# Altium schematic sheet SCH_SEGEMENTOS_MINUTERO_2.SchDoc: TP Final - Reloj - Display Minuto 2
size A4; Author: Luciano Lopez; CompanyName: UTN - FRBA; Revision: 1; SheetNumber: 8; SheetTotal: 10
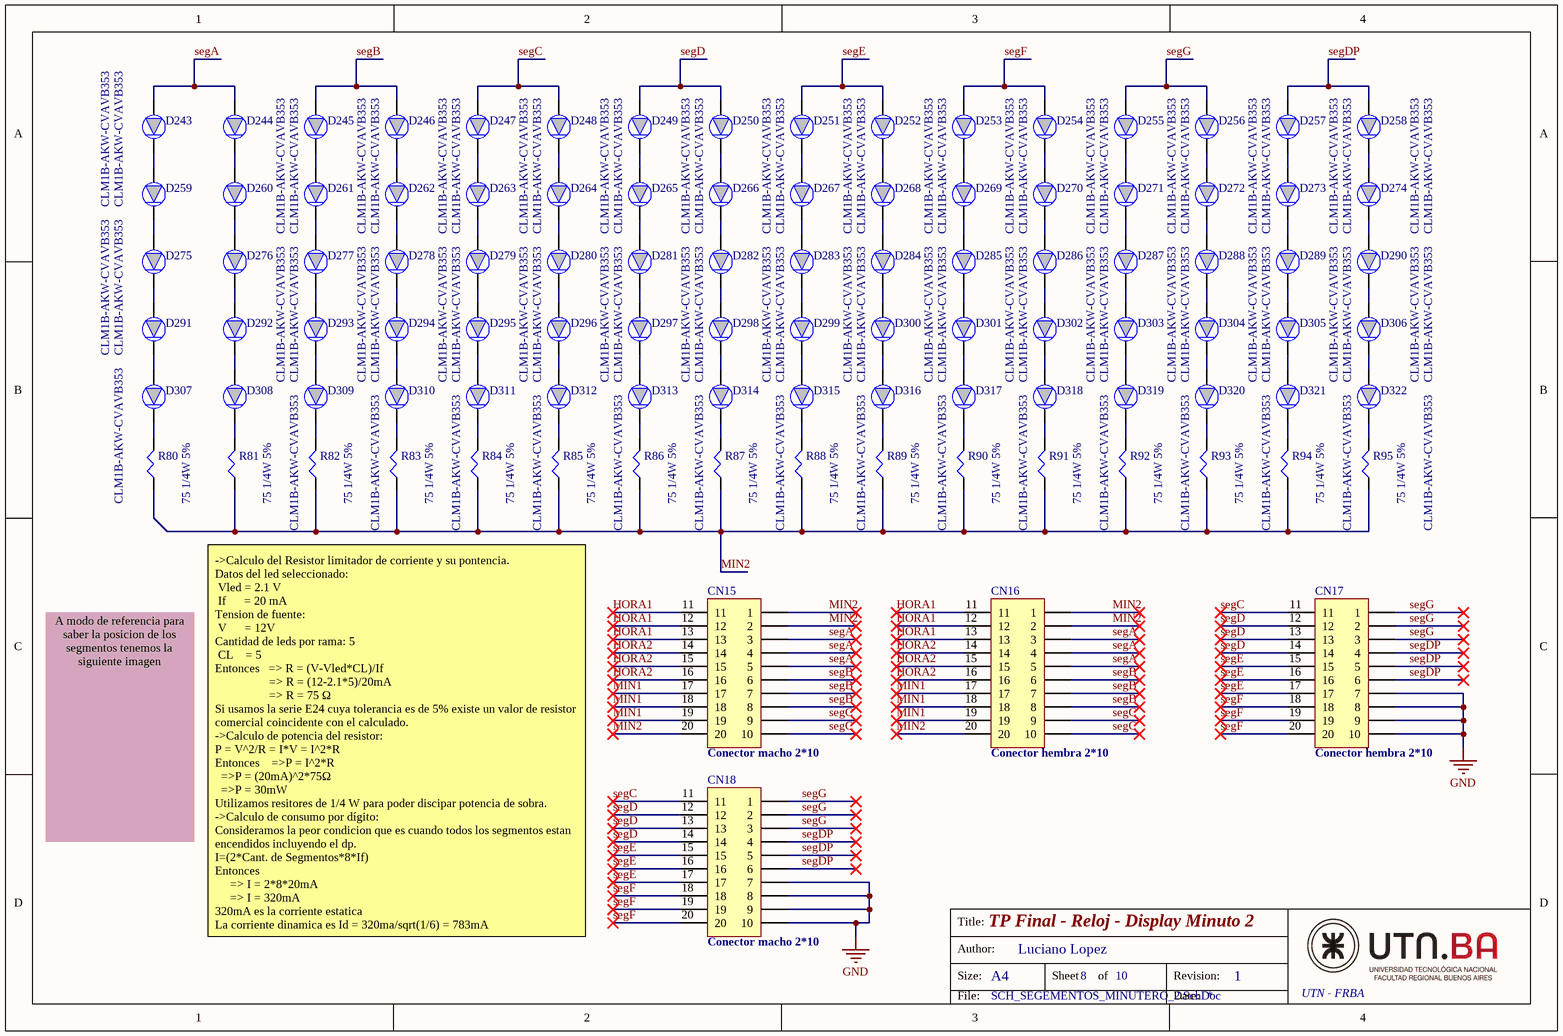
[diagram p0: SCH_SEGEMENTOS_MINUTERO_2.SchDoc]

## Parts
CN15  Conector macho 2*10
CN16  Conector hembra 2*10
CN17  Conector hembra 2*10
CN18  Conector macho 2*10
D243  CLM1B-AKW-CVAVB353  [PLCC2_LED]
D244  CLM1B-AKW-CVAVB353  [PLCC2_LED]
D245  CLM1B-AKW-CVAVB353  [PLCC2_LED]
D246  CLM1B-AKW-CVAVB353  [PLCC2_LED]
D247  CLM1B-AKW-CVAVB353  [PLCC2_LED]
D248  CLM1B-AKW-CVAVB353  [PLCC2_LED]
D249  CLM1B-AKW-CVAVB353  [PLCC2_LED]
D250  CLM1B-AKW-CVAVB353  [PLCC2_LED]
D251  CLM1B-AKW-CVAVB353  [PLCC2_LED]
D252  CLM1B-AKW-CVAVB353  [PLCC2_LED]
D253  CLM1B-AKW-CVAVB353  [PLCC2_LED]
D254  CLM1B-AKW-CVAVB353  [PLCC2_LED]
D255  CLM1B-AKW-CVAVB353  [PLCC2_LED]
D256  CLM1B-AKW-CVAVB353  [PLCC2_LED]
D257  CLM1B-AKW-CVAVB353  [PLCC2_LED]
D258  CLM1B-AKW-CVAVB353  [PLCC2_LED]
D259  CLM1B-AKW-CVAVB353  [PLCC2_LED]
D260  CLM1B-AKW-CVAVB353  [PLCC2_LED]
D261  CLM1B-AKW-CVAVB353  [PLCC2_LED]
D262  CLM1B-AKW-CVAVB353  [PLCC2_LED]
D263  CLM1B-AKW-CVAVB353  [PLCC2_LED]
D264  CLM1B-AKW-CVAVB353  [PLCC2_LED]
D265  CLM1B-AKW-CVAVB353  [PLCC2_LED]
D266  CLM1B-AKW-CVAVB353  [PLCC2_LED]
D267  CLM1B-AKW-CVAVB353  [PLCC2_LED]
D268  CLM1B-AKW-CVAVB353  [PLCC2_LED]
D269  CLM1B-AKW-CVAVB353  [PLCC2_LED]
D270  CLM1B-AKW-CVAVB353  [PLCC2_LED]
D271  CLM1B-AKW-CVAVB353  [PLCC2_LED]
D272  CLM1B-AKW-CVAVB353  [PLCC2_LED]
D273  CLM1B-AKW-CVAVB353  [PLCC2_LED]
D274  CLM1B-AKW-CVAVB353  [PLCC2_LED]
D275  CLM1B-AKW-CVAVB353  [PLCC2_LED]
D276  CLM1B-AKW-CVAVB353  [PLCC2_LED]
D277  CLM1B-AKW-CVAVB353  [PLCC2_LED]
D278  CLM1B-AKW-CVAVB353  [PLCC2_LED]
D279  CLM1B-AKW-CVAVB353  [PLCC2_LED]
D280  CLM1B-AKW-CVAVB353  [PLCC2_LED]
D281  CLM1B-AKW-CVAVB353  [PLCC2_LED]
D282  CLM1B-AKW-CVAVB353  [PLCC2_LED]
D283  CLM1B-AKW-CVAVB353  [PLCC2_LED]
D284  CLM1B-AKW-CVAVB353  [PLCC2_LED]
D285  CLM1B-AKW-CVAVB353  [PLCC2_LED]
D286  CLM1B-AKW-CVAVB353  [PLCC2_LED]
D287  CLM1B-AKW-CVAVB353  [PLCC2_LED]
D288  CLM1B-AKW-CVAVB353  [PLCC2_LED]
D289  CLM1B-AKW-CVAVB353  [PLCC2_LED]
D290  CLM1B-AKW-CVAVB353  [PLCC2_LED]
D291  CLM1B-AKW-CVAVB353  [PLCC2_LED]
D292  CLM1B-AKW-CVAVB353  [PLCC2_LED]
D293  CLM1B-AKW-CVAVB353  [PLCC2_LED]
D294  CLM1B-AKW-CVAVB353  [PLCC2_LED]
D295  CLM1B-AKW-CVAVB353  [PLCC2_LED]
D296  CLM1B-AKW-CVAVB353  [PLCC2_LED]
D297  CLM1B-AKW-CVAVB353  [PLCC2_LED]
D298  CLM1B-AKW-CVAVB353  [PLCC2_LED]
D299  CLM1B-AKW-CVAVB353  [PLCC2_LED]
D300  CLM1B-AKW-CVAVB353  [PLCC2_LED]
D301  CLM1B-AKW-CVAVB353  [PLCC2_LED]
D302  CLM1B-AKW-CVAVB353  [PLCC2_LED]
D303  CLM1B-AKW-CVAVB353  [PLCC2_LED]
D304  CLM1B-AKW-CVAVB353  [PLCC2_LED]
D305  CLM1B-AKW-CVAVB353  [PLCC2_LED]
D306  CLM1B-AKW-CVAVB353  [PLCC2_LED]
D307  CLM1B-AKW-CVAVB353  [PLCC2_LED]
D308  CLM1B-AKW-CVAVB353  [PLCC2_LED]
D309  CLM1B-AKW-CVAVB353  [PLCC2_LED]
D310  CLM1B-AKW-CVAVB353  [PLCC2_LED]
D311  CLM1B-AKW-CVAVB353  [PLCC2_LED]
D312  CLM1B-AKW-CVAVB353  [PLCC2_LED]
D313  CLM1B-AKW-CVAVB353  [PLCC2_LED]
D314  CLM1B-AKW-CVAVB353  [PLCC2_LED]
D315  CLM1B-AKW-CVAVB353  [PLCC2_LED]
D316  CLM1B-AKW-CVAVB353  [PLCC2_LED]
D317  CLM1B-AKW-CVAVB353  [PLCC2_LED]
D318  CLM1B-AKW-CVAVB353  [PLCC2_LED]
D319  CLM1B-AKW-CVAVB353  [PLCC2_LED]
D320  CLM1B-AKW-CVAVB353  [PLCC2_LED]
D321  CLM1B-AKW-CVAVB353  [PLCC2_LED]
D322  CLM1B-AKW-CVAVB353  [PLCC2_LED]
R80  75 1/4W 5%  [R_0805]
R81  75 1/4W 5%  [R_0805]
R82  75 1/4W 5%  [R_0805]
R83  75 1/4W 5%  [R_0805]
R84  75 1/4W 5%  [R_0805]
R85  75 1/4W 5%  [R_0805]
R86  75 1/4W 5%  [R_0805]
R87  75 1/4W 5%  [R_0805]
R88  75 1/4W 5%  [R_0805]
R89  75 1/4W 5%  [R_0805]
R90  75 1/4W 5%  [R_0805]
R91  75 1/4W 5%  [R_0805]
R92  75 1/4W 5%  [R_0805]
R93  75 1/4W 5%  [R_0805]
R94  75 1/4W 5%  [R_0805]
R95  75 1/4W 5%  [R_0805]

## Nets
GND: CN17.7 CN17.8 CN17.9 CN17.10 CN18.7 CN18.8 CN18.9 CN18.10
HORA1: CN15.11 CN15.12 CN15.13 CN16.11 CN16.12 CN16.13
HORA2: CN15.14 CN15.15 CN15.16 CN16.14 CN16.15 CN16.16
MIN1: CN15.17 CN15.18 CN15.19 CN16.17 CN16.18 CN16.19
MIN2: CN15.1 CN15.2 CN15.20 CN16.1 CN16.2 CN16.20 R80.47 R81.47 R82.47 R83.47 R84.47 R85.47 R86.47 R87.47 R88.47 R89.47 R90.47 R91.47 R92.47 R93.47 R94.47 R95.47
segA: CN15.3 CN15.4 CN15.5 CN16.3 CN16.4 CN16.5 D243.12 D244.12
segB: CN15.6 CN15.7 CN15.8 CN16.6 CN16.7 CN16.8 D245.12 D246.12
segC: CN15.9 CN15.10 CN16.9 CN16.10 CN17.11 CN18.11 D247.12 D248.12
segD: CN17.12 CN17.13 CN17.14 CN18.12 CN18.13 CN18.14 D249.12 D250.12
segDP: CN17.4 CN17.5 CN17.6 CN18.4 CN18.5 CN18.6 D257.12 D258.12
segE: CN17.15 CN17.16 CN17.17 CN18.15 CN18.16 CN18.17 D251.12 D252.12
segF: CN17.18 CN17.19 CN17.20 CN18.18 CN18.19 CN18.20 D253.12 D254.12
segG: CN17.1 CN17.2 CN17.3 CN18.1 CN18.2 CN18.3 D255.12 D256.12
NetD243_11: D243.11 D259.12
NetD244_11: D244.11 D260.12
NetD245_11: D245.11 D261.12
NetD246_11: D246.11 D262.12
NetD247_11: D247.11 D263.12
NetD248_11: D248.11 D264.12
NetD249_11: D249.11 D265.12
NetD250_11: D250.11 D266.12
NetD251_11: D251.11 D267.12
NetD252_11: D252.11 D268.12
NetD253_11: D253.11 D269.12
NetD254_11: D254.11 D270.12
NetD255_11: D255.11 D271.12
NetD256_11: D256.11 D272.12
NetD257_11: D257.11 D273.12
NetD258_11: D258.11 D274.12
NetD259_11: D259.11 D275.12
NetD260_11: D260.11 D276.12
NetD261_11: D261.11 D277.12
NetD262_11: D262.11 D278.12
NetD263_11: D263.11 D279.12
NetD264_11: D264.11 D280.12
NetD265_11: D265.11 D281.12
NetD266_11: D266.11 D282.12
NetD267_11: D267.11 D283.12
NetD268_11: D268.11 D284.12
NetD269_11: D269.11 D285.12
NetD270_11: D270.11 D286.12
NetD271_11: D271.11 D287.12
NetD272_11: D272.11 D288.12
NetD273_11: D273.11 D289.12
NetD274_11: D274.11 D290.12
NetD275_11: D275.11 D291.12
NetD276_11: D276.11 D292.12
NetD277_11: D277.11 D293.12
NetD278_11: D278.11 D294.12
NetD279_11: D279.11 D295.12
NetD280_11: D280.11 D296.12
NetD281_11: D281.11 D297.12
NetD282_11: D282.11 D298.12
NetD283_11: D283.11 D299.12
NetD284_11: D284.11 D300.12
NetD285_11: D285.11 D301.12
NetD286_11: D286.11 D302.12
NetD287_11: D287.11 D303.12
NetD288_11: D288.11 D304.12
NetD289_11: D289.11 D305.12
NetD290_11: D290.11 D306.12
NetD291_11: D291.11 D307.12
NetD292_11: D292.11 D308.12
NetD293_11: D293.11 D309.12
NetD294_11: D294.11 D310.12
NetD295_11: D295.11 D311.12
NetD296_11: D296.11 D312.12
NetD297_11: D297.11 D313.12
NetD298_11: D298.11 D314.12
NetD299_11: D299.11 D315.12
NetD300_11: D300.11 D316.12
NetD301_11: D301.11 D317.12
NetD302_11: D302.11 D318.12
NetD303_11: D303.11 D319.12
NetD304_11: D304.11 D320.12
NetD305_11: D305.11 D321.12
NetD306_11: D306.11 D322.12
NetD307_11: D307.11 R80.48
NetD308_11: D308.11 R81.48
NetD309_11: D309.11 R82.48
NetD310_11: D310.11 R83.48
NetD311_11: D311.11 R84.48
NetD312_11: D312.11 R85.48
NetD313_11: D313.11 R86.48
NetD314_11: D314.11 R87.48
NetD315_11: D315.11 R88.48
NetD316_11: D316.11 R89.48
NetD317_11: D317.11 R90.48
NetD318_11: D318.11 R91.48
NetD319_11: D319.11 R92.48
NetD320_11: D320.11 R93.48
NetD321_11: D321.11 R94.48
NetD322_11: D322.11 R95.48

## Notes on the sheet
- A modo de referencia para saber la posicion de los segmentos tenemos la siguiente imagen
- ->Calculo del Resistor limitador de corriente y su pontencia.
  Datos del led seleccionado:
  Vled = 2.1 V
  If      = 20 mA
  Tension de fuente:
  V      = 12V
  Cantidad de leds por rama: 5
  CL    = 5
  Entonces   => R = (V-Vled*CL)/If
  => R = (12-2.1*5)/20mA
  => R = 75 Ω
  Si usamos la serie E24 cuya tolerancia es de 5% existe un valor de resistor comercial coincidente con el calculado.
  ->Calculo de potencia del resistor:
  P = V^2/R = I*V = I^2*R
  Entonces    =>P = I^2*R
  =>P = (20mA)^2*75Ω
  =>P = 30mW
  Utilizamos resitores de 1/4 W para poder discipar potencia de sobra.
  ->Calculo de consumo por dígito:
  Consideramos la peor condicion que es cuando todos los segmentos estan encendidos incluyendo el dp.
  I=(2*Cant. de Segmentos*8*If)
  Entonces
  => I = 2*8*20mA
  => I = 320mA
  320mA es la corriente estatica
  La corriente dinamica es Id = 320ma/sqrt(1/6) = 783mA
- Title:
- Size:
- Author:
- A4
- Sheet
- of
- Revision:
- File:
- Date:

## Library data of the parts
CN15-CN18 = CONN_2x10P: Connector Generic 10 Vias
D243-D322 = LED_DIODE
R80-R95 = Resistor